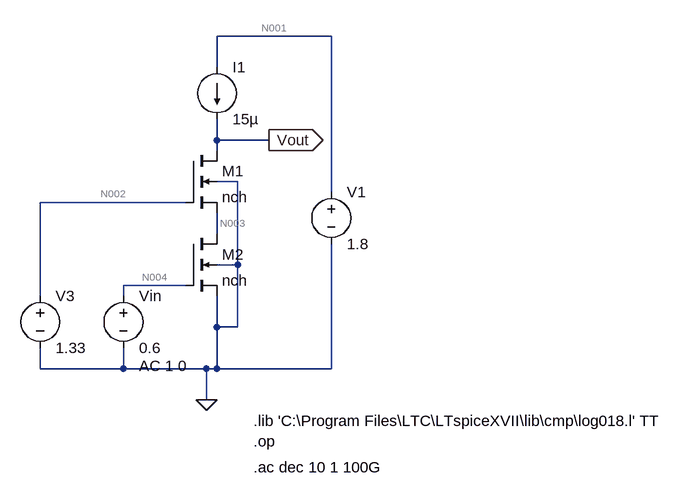
[diagram p0: schematic Week 3 Exc3.asc]
Week 3 Exc3.asc, the LTspice schematic file:
Version 4
SHEET 1 1008 680
WIRE 416 -16 240 -16
WIRE 240 32 240 -16
WIRE 240 144 240 112
WIRE 320 144 240 144
WIRE 240 160 240 144
WIRE 272 208 240 208
WIRE 416 224 416 -16
WIRE 192 240 -32 240
WIRE 240 288 240 256
WIRE 272 336 272 208
WIRE 272 336 240 336
WIRE 192 368 96 368
WIRE -32 384 -32 240
WIRE 96 384 96 368
WIRE 240 432 240 384
WIRE 272 432 272 336
WIRE 272 432 240 432
WIRE -32 496 -32 464
WIRE 96 496 96 464
WIRE 96 496 -32 496
WIRE 224 496 96 496
WIRE 240 496 240 432
WIRE 240 496 224 496
WIRE 416 496 416 304
WIRE 416 496 240 496
WIRE 224 544 224 496
FLAG 224 544 0
FLAG 320 144 Vout
IOPIN 320 144 Out
SYMBOL nmos4 192 160 R0
SYMATTR InstName M1
SYMATTR Value nch
SYMATTR Value2 l=0.18u w=1u
SYMBOL nmos4 192 288 R0
SYMATTR InstName M2
SYMATTR Value nch
SYMATTR Value2 l=0.18u w=1u
SYMBOL current 240 32 R0
WINDOW 123 0 0 Left 0
WINDOW 39 0 0 Left 0
SYMATTR InstName I1
SYMATTR Value 15µ
SYMBOL voltage 416 208 R0
WINDOW 123 0 0 Left 0
WINDOW 39 0 0 Left 0
SYMATTR InstName V1
SYMATTR Value 1.8
SYMBOL voltage 96 368 R0
WINDOW 123 24 124 Left 2
WINDOW 39 0 0 Left 0
SYMATTR Value2 AC 1 0
SYMATTR InstName Vin
SYMATTR Value 0.6
SYMBOL voltage -32 368 R0
WINDOW 123 0 0 Left 0
WINDOW 39 0 0 Left 0
SYMATTR InstName V3
SYMATTR Value 1.33
TEXT 296 576 Left 2 !.lib 'C:\\Program Files\\LTC\\LTspiceXVII\\lib\\cmp\\log018.l' TT
TEXT 296 608 Left 2 !.op
TEXT 296 648 Left 2 !.ac dec 10 1 100G

The netlist it stands for:
* Week 3 Exc3.asc
M1 Vout N002 N003 0 nch l=0.18u w=1u
M2 N003 N004 0 0 nch l=0.18u w=1u
I1 N001 Vout 15µ
V1 N001 0 1.8
Vin N004 0 0.6 AC 1 0
V3 N002 0 1.33
.model NMOS NMOS
.model PMOS PMOS
.lib standard.mos
.lib 'C:\Program Files\LTC\LTspiceXVII\lib\cmp\log018.l' TT
.op
.ac dec 10 1 100G
.backanno
.end

* Results of the author's LTspice run, read from the files saved beside the schematic
* Operating Point, zero values left out:
*   V(vout) = 1.407 V
*   V(n002) = 1.33 V
*   V(n003) = 590.8 mV
*   V(n004) = 600 mV
*   V(n001) = 1.8 V
*   Id(M2) = 15 µA
*   Is(M2) = -15 µA
*   Id(M1) = 15 µA
*   Ib(M1) = -2.452 pA
*   Is(M1) = -15 µA
*   I(I1) = 15 µA
*   I(V1) = -15 µA
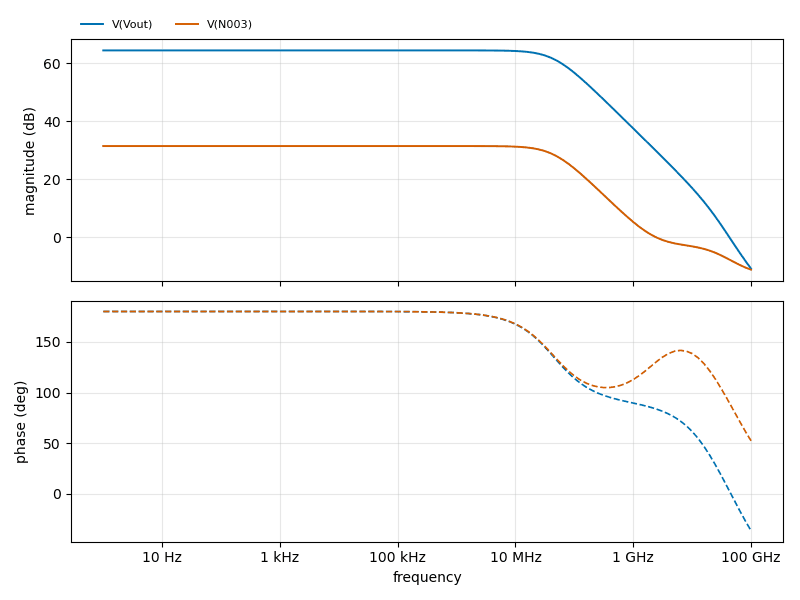
[diagram p1: AC Analysis of Week 3 Exc3.asc, plotted from the saved traces]
* AC Analysis, 1 run:
*   V(Vout): 64.46 dB at 1 Hz, -10.89 dB at 100 GHz, peak 64.46 dB at 1 Hz, 3 dB below the peak at 44.68 MHz
*   V(N003): 31.44 dB at 1 Hz, -11.26 dB at 100 GHz, peak 31.44 dB at 1 Hz, 3 dB below the peak at 44.7 MHz
* From the log:
*   Semiconductor Device Operating Points:
*                           --- BSIM3 MOSFETS ---
*   Name:        m2          m1
*   Model:      nch.9       nch.9
*   Id:        1.50e-05    1.50e-05
*   Vgs:       6.00e-01    7.39e-01
*   Vds:       5.91e-01    8.16e-01
*   Vbs:       0.00e+00   -5.91e-01
*   Vth:       5.25e-01    6.71e-01
*   Vdsat:     1.01e-01    1.03e-01
*   Gm:        1.88e-04    1.91e-04
*   Gds:       5.03e-06    5.26e-06
*   Gmb        5.53e-05    3.95e-05
*   Cbd:       0.00e+00    0.00e+00
*   Cbs:       0.00e+00    0.00e+00
*   Cgsov:     3.59e-16    3.59e-16
*   Cgdov:     3.59e-16    3.59e-16
*   Cgbov:     3.18e-17    3.18e-17
*   dQgdVgb:   1.77e-15    1.74e-15
*   dQgdVdb:  -3.58e-16   -3.54e-16
*   dQgdVsb:  -1.19e-15   -1.18e-15
*   dQddVgb:  -3.61e-16   -3.60e-16
*   dQddVdb:   3.60e-16    3.59e-16
*   dQddVsb:   1.61e-18    7.94e-19
*   dQbdVgb:  -2.64e-16   -2.46e-16
*   dQbdVdb:   2.43e-19    7.39e-19
*   dQbdVsb:  -1.93e-16   -1.24e-16